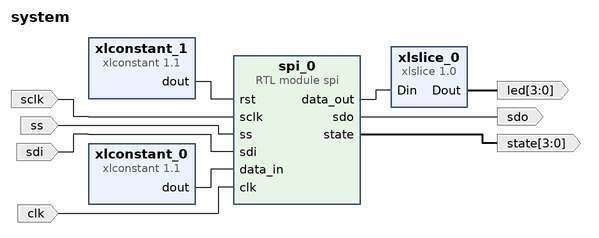
[diagram p0: block diagram of the top level]
# Vivado block design system, xc7z020clg400-1, Vivado 2020.2
create_bd_design system

create_bd_port -dir I sclk
create_bd_port -dir I sdi
create_bd_port -dir I ss
create_bd_port -dir I -type clk clk
set_property -dict {CONFIG.FREQ_HZ 125000000} [get_bd_ports clk]
create_bd_port -dir O sdo
create_bd_port -dir O -from 3 -to 0 led
create_bd_port -dir O -from 3 -to 0 state

create_bd_cell -type ip -vlnv xilinx.com:ip:xlconstant:1.1 xlconstant_0
set_property -dict {CONFIG.CONST_VAL 0b11010111 CONFIG.CONST_WIDTH 8} [get_bd_cells xlconstant_0]
create_bd_cell -type ip -vlnv xilinx.com:ip:xlconstant:1.1 xlconstant_1
set_property -dict {CONFIG.CONST_VAL 0} [get_bd_cells xlconstant_1]
create_bd_cell -type ip -vlnv xilinx.com:ip:xlslice:1.0 xlslice_0
set_property -dict {CONFIG.DIN_FROM 3 CONFIG.DIN_WIDTH 8 CONFIG.DOUT_WIDTH 4} [get_bd_cells xlslice_0]
create_bd_cell -type module -reference spi spi_0

# ---- connections ----

connect_bd_net [get_bd_pins xlslice_0/Dout] [get_bd_ports led]
connect_bd_net [get_bd_pins xlconstant_1/dout] [get_bd_pins spi_0/rst]
connect_bd_net -net sck_1 [get_bd_ports sclk] [get_bd_pins spi_0/sclk]
connect_bd_net [get_bd_ports ss] [get_bd_pins spi_0/ss]
connect_bd_net -net mosi_1 [get_bd_ports sdi] [get_bd_pins spi_0/sdi]
connect_bd_net [get_bd_pins xlconstant_0/dout] [get_bd_pins spi_0/data_in]
connect_bd_net [get_bd_pins spi_0/data_out] [get_bd_pins xlslice_0/Din]
connect_bd_net [get_bd_pins spi_0/state] [get_bd_ports state]
connect_bd_net [get_bd_pins spi_0/sdo] [get_bd_ports sdo]
connect_bd_net [get_bd_ports clk] [get_bd_pins spi_0/clk]

validate_bd_design
save_bd_design
